# EasyEDA Pro project ProPrj_改进的小熊NFC钥匙扣_2025-08-22.epro

# Schematic nfc自制
Board Name: 小熊NFC; Create Date: 2023-08-22; Page Name: Sheet_1; Project Name: 改进的小熊NFC钥匙扣; Schematic Name: nfc自制; Update Date: 2023-12-07; Add into BOM: yes; Company: Your Company; Convert to PCB: yes; Date: 2022-11-21; Draw By: zyqsdv; REV: 1.0; Sheet: 1/1
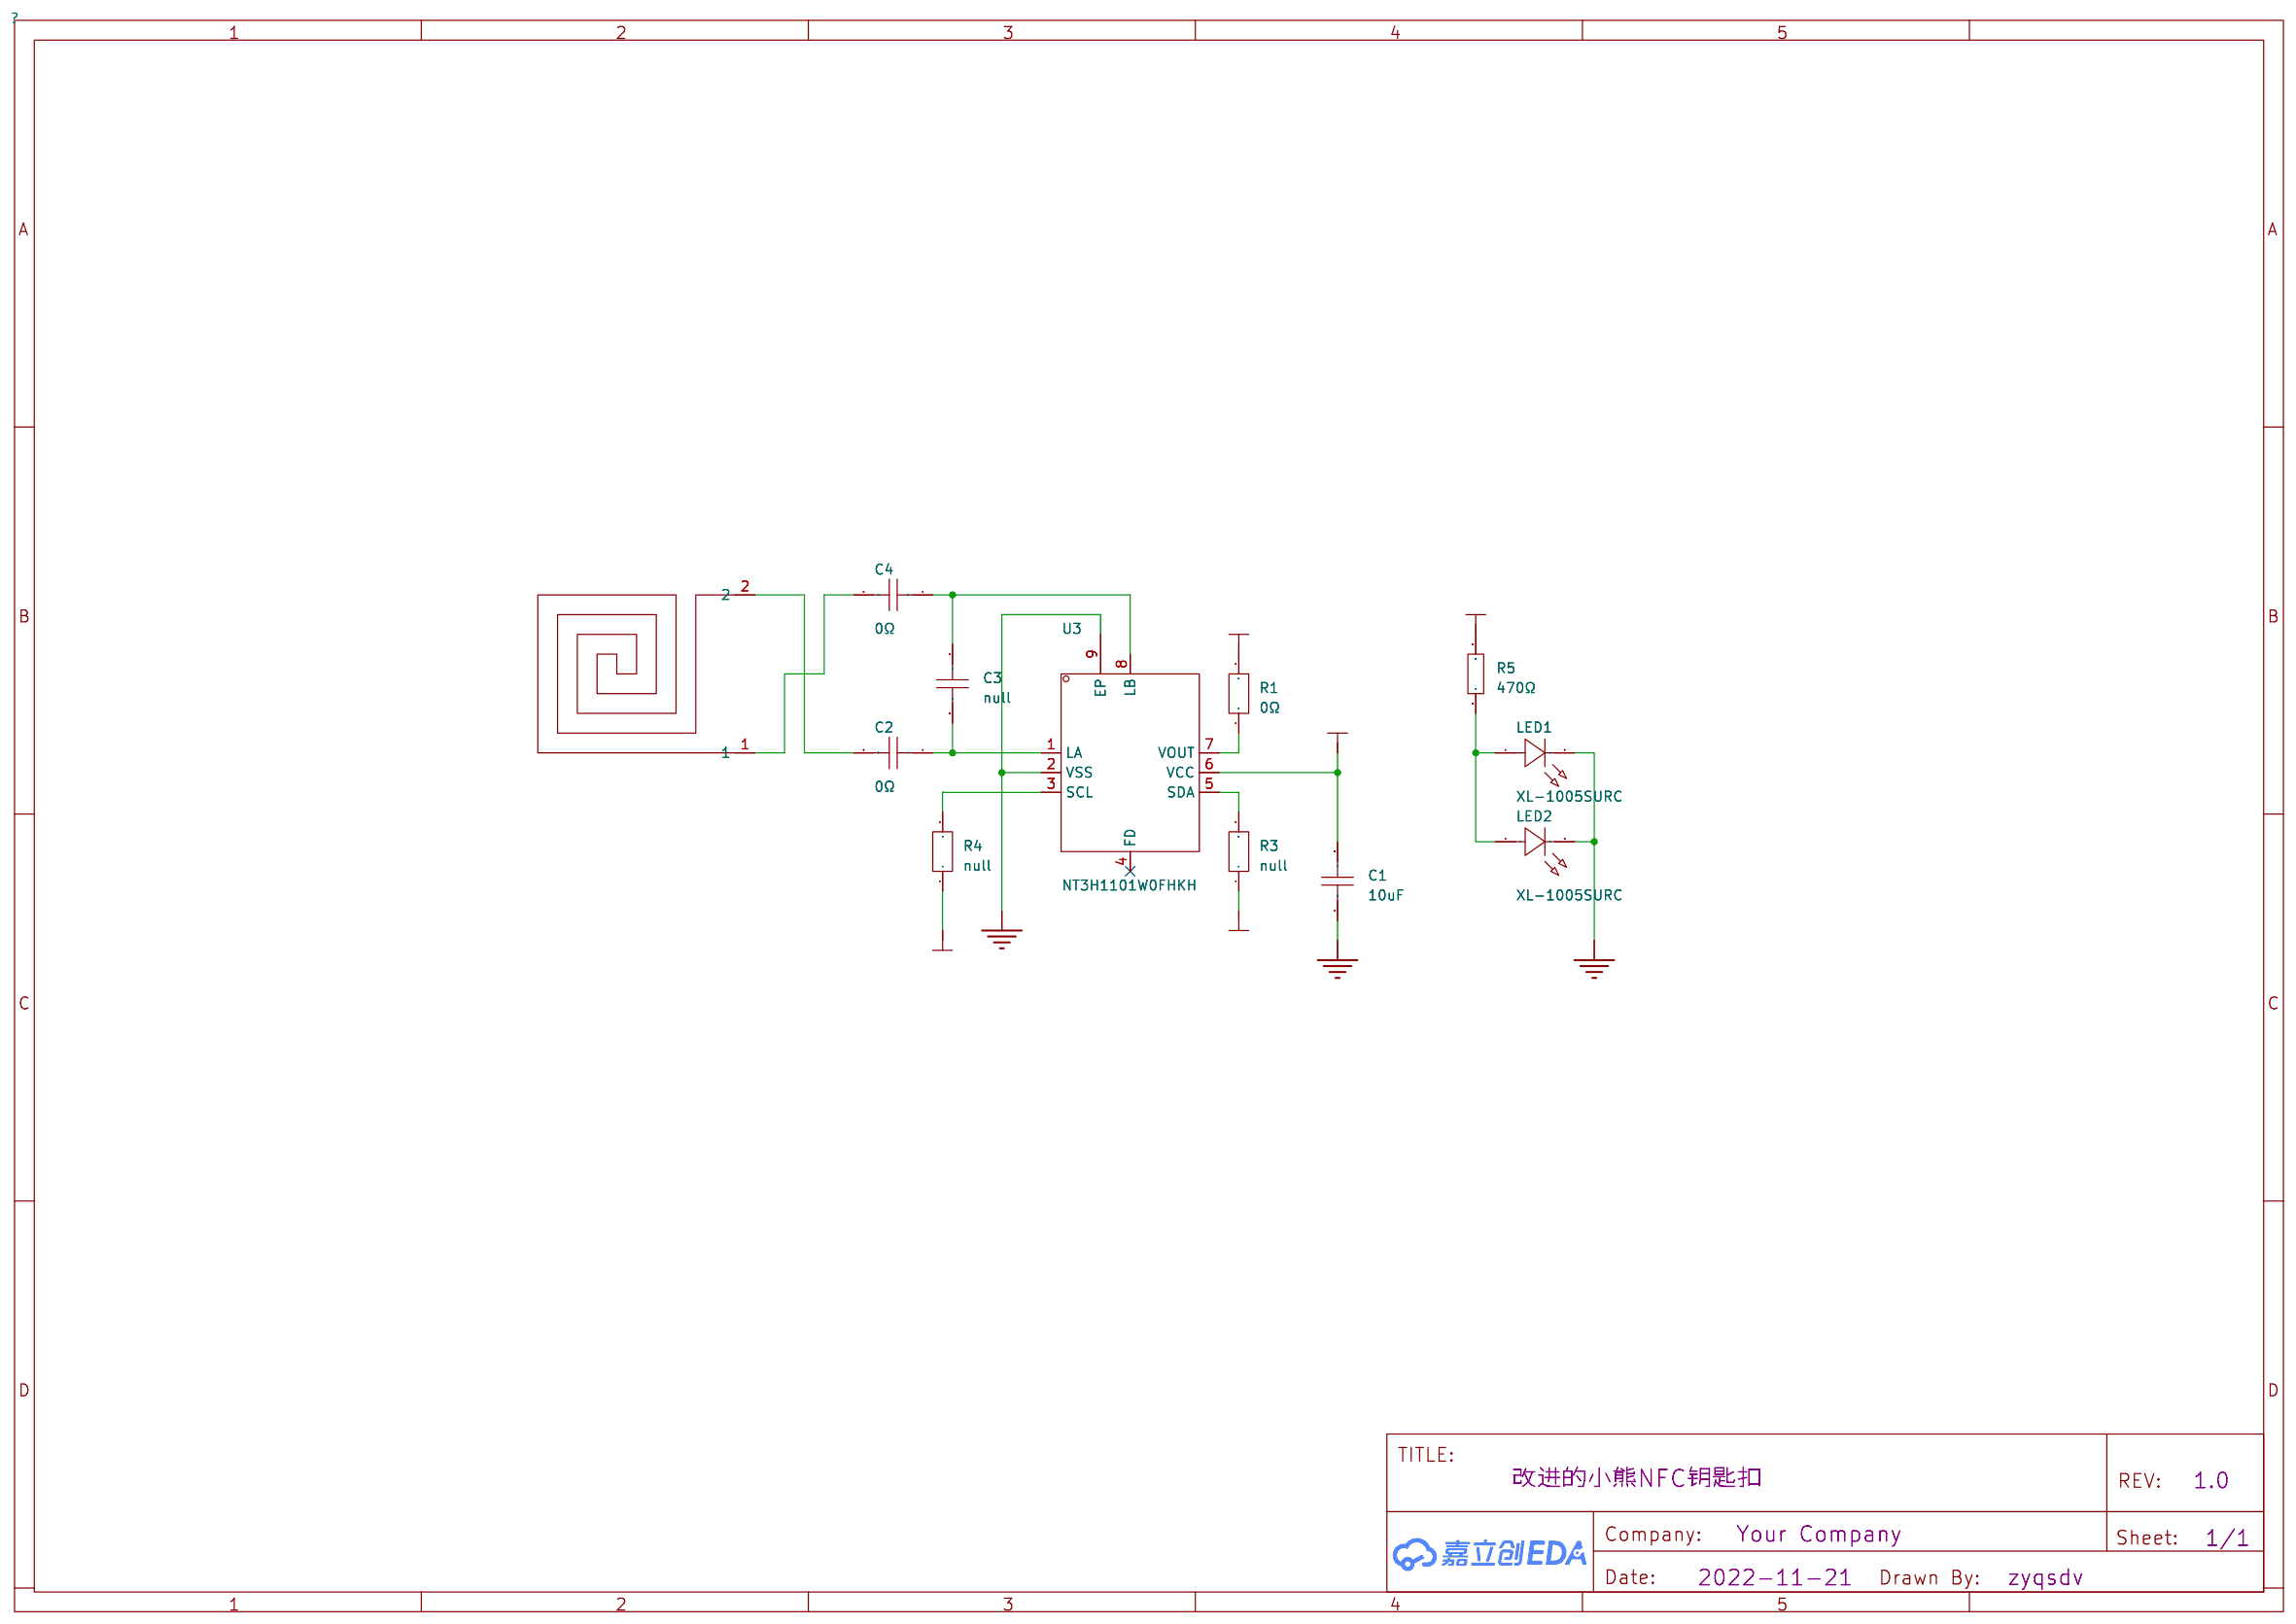
[diagram p0: schematic sheet]

## Parts
A1  -  [aNFC_23x30_2u7_1356]
C1  10uF  [C0402]
C2  0Ω  [C0402]
C3  null  [C0402]
C4  0Ω  [C0402]
LED1  XL-1005SURC  [LED0402-R-RD_RED]
LED2  XL-1005SURC  [LED0402-R-RD_RED]
R1  0Ω  [R0201]
R3  null  [R0201]
R4  null  [R0201]
R5  470Ω  [R0402]
U3  NT3H1101W0FHKH  [XQFN-8_L1.6-W1.6-P0.50-BR]

## Library data of the parts
A1 = NFCAnt
C1-C4 = CC0402KRX7R7BB104: 容值:100nF;精度:±10%;额定电压:16V;材质(温度系数):X7R;; LCSC Part Name: 100nF ±10% 16V; Supplier Part: C60474; Manufacturer: YAGEO(国巨); Supplier Footprint: 0402; JLCPCB Part Class: 扩展库; Datasheet: https://atta.szlcsc.com/upload/public/pdf/source/20211223/9278FD768280B81DDBEF48FA36411A03.pdf; Supplier: LCSC; Tolerance: ±10%; Voltage Rated: 16V; Temperature Coefficient: X7R
LED1 LED2 = XL-1005SURC: 发光颜色:红灯;主波长:620nm;色温:6000K~7000K;功率:55mW;安装方式:正贴;; LCSC Part Name: 红灯 正贴 色温6000K~7000K; Supplier Part: C965790; Manufacturer: XINGLIGHT(成兴光); Supplier Footprint: 0402; JLCPCB Part Class: Extended Part; Datasheet: https://atta.szlcsc.com/upload/public/pdf/source/20221102/EBA3AB29C2D5B62EE70B36967F8F8809.pdf; Supplier: LCSC; Emitted Color: 红灯; Lens Color: 无色透明; Dominant Wavelength: 620nm; Peak Wavelength: 625nm; Color Temperature: 6000K~7000K; Forward Current: 25mA; Power Dissipation: 55mW; Viewing Angle: 120°; Mounting Sytle: 正贴; Operating Temperature: -30℃~+85℃
R1 R3 R4 = 0201WMF0000TEE: 阻值:0Ω;精度:±1%;功率:50mW;电阻类型:厚膜电阻;; LCSC Part Name: 0Ω ±1% 50mW 厚膜电阻; Supplier Part: C473473; Manufacturer: UNI-ROYAL(厚声); Supplier Footprint: 0201; JLCPCB Part Class: 扩展库; Datasheet: https://atta.szlcsc.com/upload/public/pdf/source/20200306/C422600_1E6D84923E4A46A82E41ADD87F860B5C.pdf; Supplier: LCSC; Tolerance: ±1%; Power(Watts): 50mW; Overload Voltage (Max): 25V; Type: 厚膜电阻; Operating Temperature Range: -55℃~+155℃
R5 = 0402WGF4700TCE: 阻值:470Ω;精度:±1%;功率:62.5mW;温度系数:±100ppm/℃;电阻类型:厚膜电阻;; LCSC Part Name: 470Ω ±1% 62.5mW 厚膜电阻; Supplier Part: C25117; Manufacturer: UNI-ROYAL(厚声); Supplier Footprint: 0402; JLCPCB Part Class: 基础库; Datasheet: https://atta.szlcsc.com/upload/public/pdf/source/20200306/C422600_1E6D84923E4A46A82E41ADD87F860B5C.pdf; Supplier: LCSC; Tolerance: ±1%; Power(Watts): 62.5mW; Overload Voltage (Max): 50V; Temperature Coefficient: ±100ppm/℃; Type: 厚膜电阻; Operating Temperature Range: -55℃~+155℃
U3 = NT3H1101W0FHKH: Supplier Part: C73156; Manufacturer: NXP(恩智浦); Supplier Footprint: XQFN-8(1.6x1.6); JLCPCB Part Class: Extended Part; Datasheet: https://atta.szlcsc.com/upload/public/pdf/source/20171113/C73156_15105616225541116096.pdf; Supplier: LCSC

## Nets
GND: C1.1 LED1.2(A) LED2.2(A) U3.2(VSS) U3.9(EP)
VCCRF: C1.2 R1.2 R3.1 R4.1 R5.2 U3.6(VCC)
$1N2341: R1.1 U3.7(VOUT)
$1N2352: LED1.1(K) LED2.1(K) R5.1
$1N2409: R4.2 U3.3(SCL)
$1N2413: R3.2 U3.5(SDA)
$1N2468: C2.1 C3.2 U3.1(LA)
$1N2887: C3.1 C4.1 U3.8(LB)
$1N3760: A1.2 C2.2
$1N3765: A1.1 C4.2

Not connected (* = marked no-connect by the designer): U3 4(FD)*

# Board PCB1_1
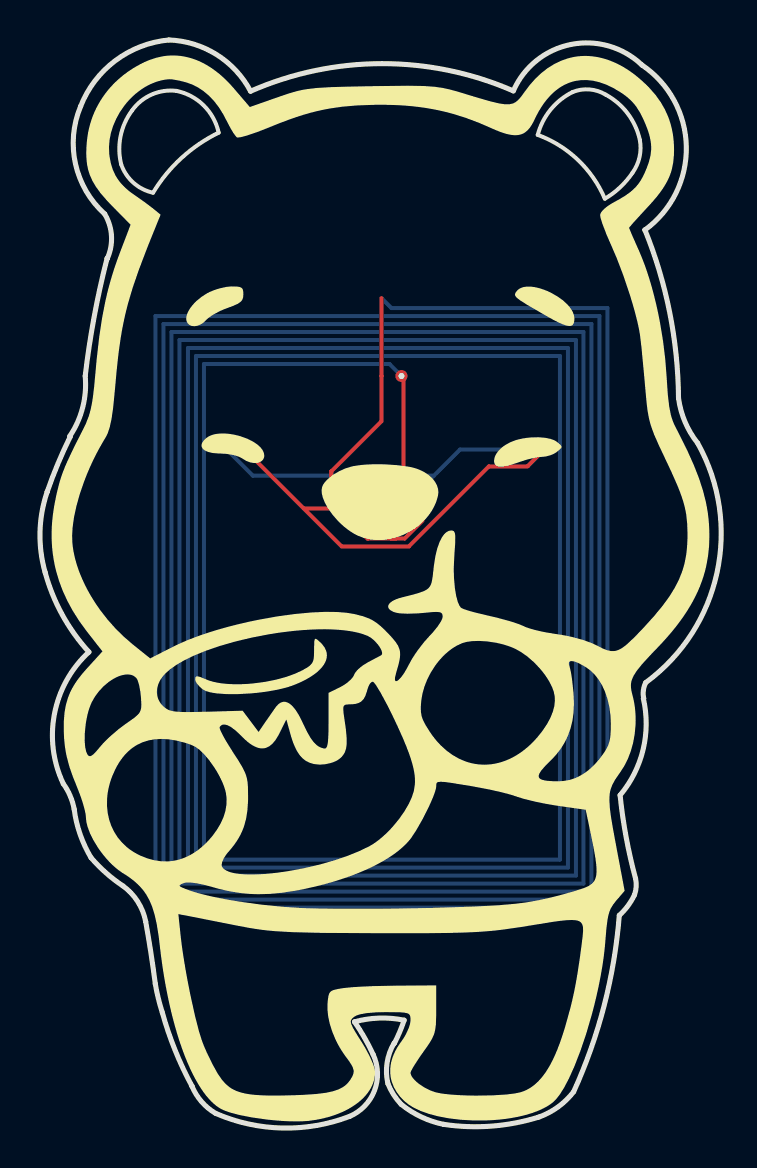
[diagram p1: board, top side]
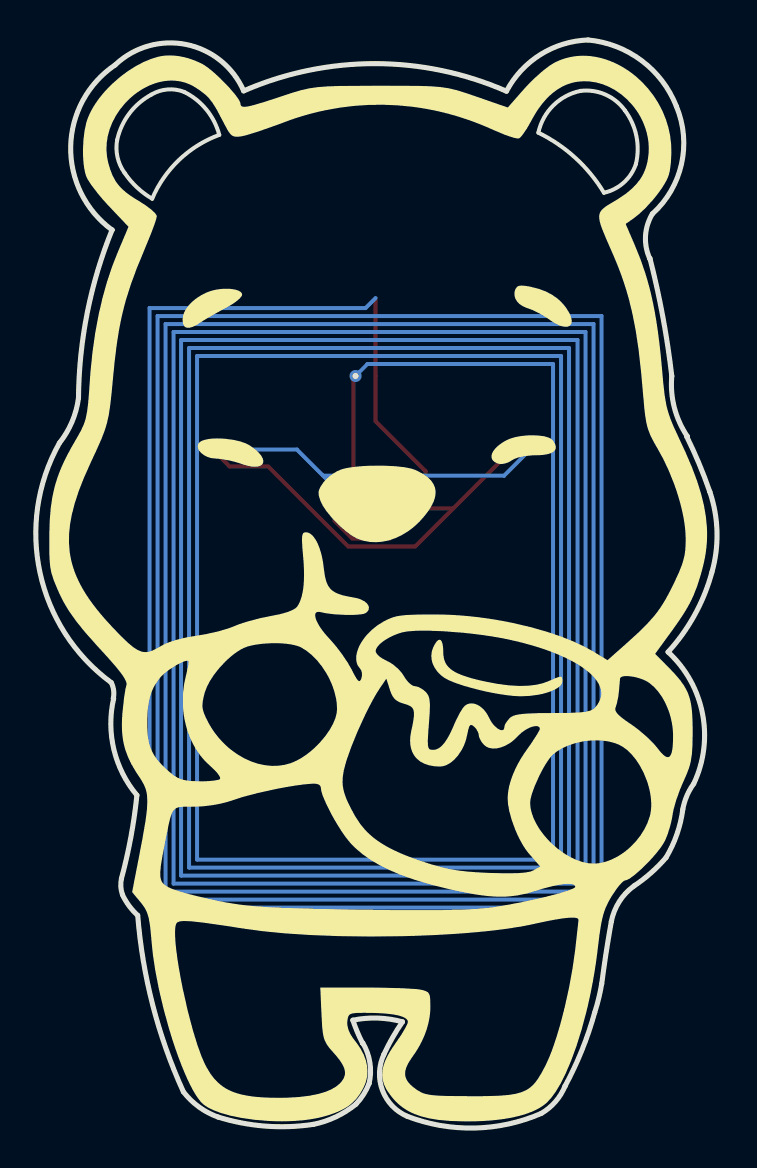
[diagram p2: board, bottom side, seen from below]

Outline 34.06 x 54.45 mm; copper layers: Top Layer, Bottom Layer. Coordinates in mm from the lower left corner of the outline.
Outline path: 0.26,27.82 arc(0,29.81) 0.36,31.83 0.37,31.85 arc(0.9,33.25) 1.52,34.6 1.49,34.62 arc(2.13,36.02) 2.26,37.63 arc(2.72,40.63) 3.35,43.51 3.37,43.51 arc(3.58,44.62) 3.24,45.74 arc(1.76,48.34) 2.03,51.12 arc(3.71,53.37) 6.45,54.45 arc(8.83,53.71) 10.53,51.88 arc(17.1,53.26) 23.67,51.9 arc(26.54,54.22) 30.1,53.19 arc(32.32,49.11) 30.25,44.94 arc(31.49,40.81) 31.93,36.53 arc(32.25,35.34) 32.88,34.28 arc(33.85,27.79) 30.29,22.29 arc(30.17,21.91) 30.19,21.5 30.17,21.49 arc(30.16,18.96) 29.01,16.65 arc(29.32,14.5) 29.78,12.49 arc(29.81,12.1) 29.73,11.67 arc(29.41,11.13) 28.97,10.64 arc(28.21,6.12) 26.68,1.82 arc(25.91,1.06) 24.95,0.55 arc(22.59,0.1) 20.19,0.19 20.19,0.18 arc(19.07,0.56) 18.06,1.19 arc(17.68,1.68) 17.4,2.23 arc(17.36,3.27) 17.71,4.26 17.73,4.25 arc(17.99,4.82) 18.21,5.4 arc(16.96,5.5) 15.73,5.32 arc(16.22,4.54) 16.66,3.68 arc(16.72,1.87) 15.49,0.59 arc(12.1,0) 8.79,0.73 arc(8.09,1.31) 7.6,2.1 7.6,2.1 arc(6.75,3.9) 6.12,5.78 arc(5.92,6.48) 5.77,7.22 arc(5.54,8.85) 5.29,10.33 arc(4.93,11.27) 4.15,12.12 arc(3.28,12.78) 2.55,13.53 arc(2.01,14.69) 1.71,15.96 arc(1.51,16.62) 1.17,17.23 arc(0.73,20.73) 2.45,23.82 arc(1.1,25.71) 0.26,27.82 ; 4.06,48.23 arc(4.03,49.63) 4.6,50.92 arc(5.58,51.71) 6.83,51.9 arc(8.19,51.16) 8.93,49.81 arc(7.08,48.54) 5.65,46.8 arc(4.67,47.31) 4.06,48.23 ; 24.89,49.7 arc(25.53,50.96) 26.63,51.84 arc(27.47,51.97) 28.28,51.71 arc(29.39,50.77) 29.99,49.45 arc(29.98,48.58) 29.62,47.8 arc(29.01,47.07) 28.24,46.5 arc(26.9,48.45) 24.89,49.7
Stack: Top Layer 0.035mm / Dielectric1 1.51mm FR4 er 4.5 / Bottom Layer 0.035mm

## Design rules (mm)
template: JLCPCB Capability(Two Layers Board)
spacing copperThickness1oz (default): track to track 0.102, other pairs 0.152 to 0.3
spacing copperThickness2oz: track to track 0.203, other pairs 0.152 to 0.3
track width copperThickness1oz (default): min 0.127, default 0.254, max 2.54
track width copperThickness2oz: min 0.203, default 0.254, max 2.54
differential pair differentialPair (default): width min 0.127, default 0.254, max 2.54; gap min 0.152, default 0.152
via viaSize (default): diameter min 0.5, default 0.61, max 10; hole min 0.3, default 0.305, max 6.3

## Placement (name value [footprint] x y rotation side)
A1  -  [anfc_23x30_2u7_1356]  5.77 11.03 90 bottom
C1  10uF  [C0402]  19.12 31.68 270 top
C2  0Ω  [C0402]  14.88 32.09 225 top
C3  null  [C0402]  16.11 32.3 225 top
C4  0Ω  [C0402]  17.73 32.58 0 top
LED1  XL-1005SURC  [LED0402-R-RD_RED]  9.56 34.13 0 top
LED2  XL-1005SURC  [LED0402-R-RD_RED]  24.51 33.95 0 top
NOREF  -  [Pad_e48]  27.83 49.94 90 top
NOREF#2  -  [Pad_e46]  6.13 50 90 top
R1  0Ω  [R0201]  18.47 31.68 270 top
R3  null  [R0201]  18.47 30.77 270 top
R4  null  [R0201]  16.84 29.99 180 top
R5  470Ω  [R0402]  15.41 30.7 315 top
U3  NT3H1101W0FHKH  [xqfn-8_l1.6-w1.6-p0.50-br]  17.23 31.22 180 top

## Footprints (pads in the part's own frame, mm; a bottom-side part is the same pattern mirrored in y, then rotated)
anfc_23x30_2u7_1356
  round 0.6 hole 0.3: 1(26.6,12.3)
  round 0.2 smd far side: 2(26.6,11.3)
C0402
  rect 0.4x0.54 smd: 1(-0.45,0) 2(0.45,0)
LED0402-R-RD_RED
  rect 0.4x0.6 smd: 1(0.498,0) 2(-0.493,0)
Pad_e46
  round 0.003 hole 3.5: 0(0,0)
Pad_e48
  round 0.003 hole 3.5: 0(0,0)
R0201
  rect 0.303x0.324 smd: 1(-0.241,0) 2(0.241,0)
R0402
  rect 0.566x0.54 smd: 1(-0.433,0) 2(0.433,0)
xqfn-8_l1.6-w1.6-p0.50-br
  oval 0.5x0.3 smd: 1(0.65,-0.5)
  rect 0.5x0.3 smd: 2(0.65,0) 3(0.65,0.5) 5(-0.65,0.5) 6(-0.65,0) 7(-0.65,-0.5)
  rect 0.3x0.5 smd: 4(0,0.6) 8(0,-0.6)
  rect 0.3x0.3 smd: 9(0,0)

## Nets
As in the schematic.

Pads without a net: NOREF 0; NOREF#2 0; U3 4

## Via types
v1: diameter 0.61, hole 0.305, Top Layer to Bottom Layer, 5 vias

## Routing (per net, layer and track width the routed paths; a pad name or vN(x,y) marks a point on that pad's centre or on a via; arc(x,y) is an arc through that point)
GND: length 21.8
  Top Layer w0.3: v1(15.96,31.18) 16,31.22 U3.9
  Bottom Layer w0.2: v1(9.16,34.13) 10.65,32.65 19.7,32.65 ; v1(15.96,31.18) 16.85,32.07 v1(19.12,32.07) 21,33.95 v1(24.11,33.95)
VCCRF: length 7.3
  Top Layer w0.2: 15.72,30.4 15.72,30.16 16.38,29.5 18.23,29.5 19.12,30.39 19.12,31.3 ; R4.1 17.58,29.5 17.8,29.5
  Top Layer w0.3: U3.6 19.11,31.22 C1.2
  vias: v1(19.12,31.29)
$1N2341: length 0.7
  Top Layer w0.2: U3.7 18.08,31.92 R1.1
$1N2352: length 21.1
  Top Layer w0.2: 13.19,31.01 10.06,34.13 ; 13.19,31.01 15.09,29.1 18.44,29.1 22.44,33.11 24.37,33.11 25.01,33.75 LED2.1 ; 13.19,31.01 R5.1
$1N2409: length 0.7
  Top Layer w0.3: U3.3 16.6,30.7 R4.2
$1N2413: length 0.7
  Top Layer w0.2: U3.5 18.08,30.53 R3.2
$1N2468: length 1.7
  Top Layer w0.2: 15.2,32.41 15.47,32.41 16.02,31.86 16.45,31.86 U3.1
$1N2887: length 1.6
  Top Layer w0.3: 17.3,32.59 17.23,32.52 U3.8
  Top Layer w0.4: 16.41,32.57 16.42,32.58 17.25,32.58
$1N3760: length 6.9
  Top Layer w0.2: 14.57,31.77 14.57,32.86 17.07,35.37 A1.2
$1N3765: length 5.1
  Top Layer w0.2: A1.1 18.18,37.52 C4.2
